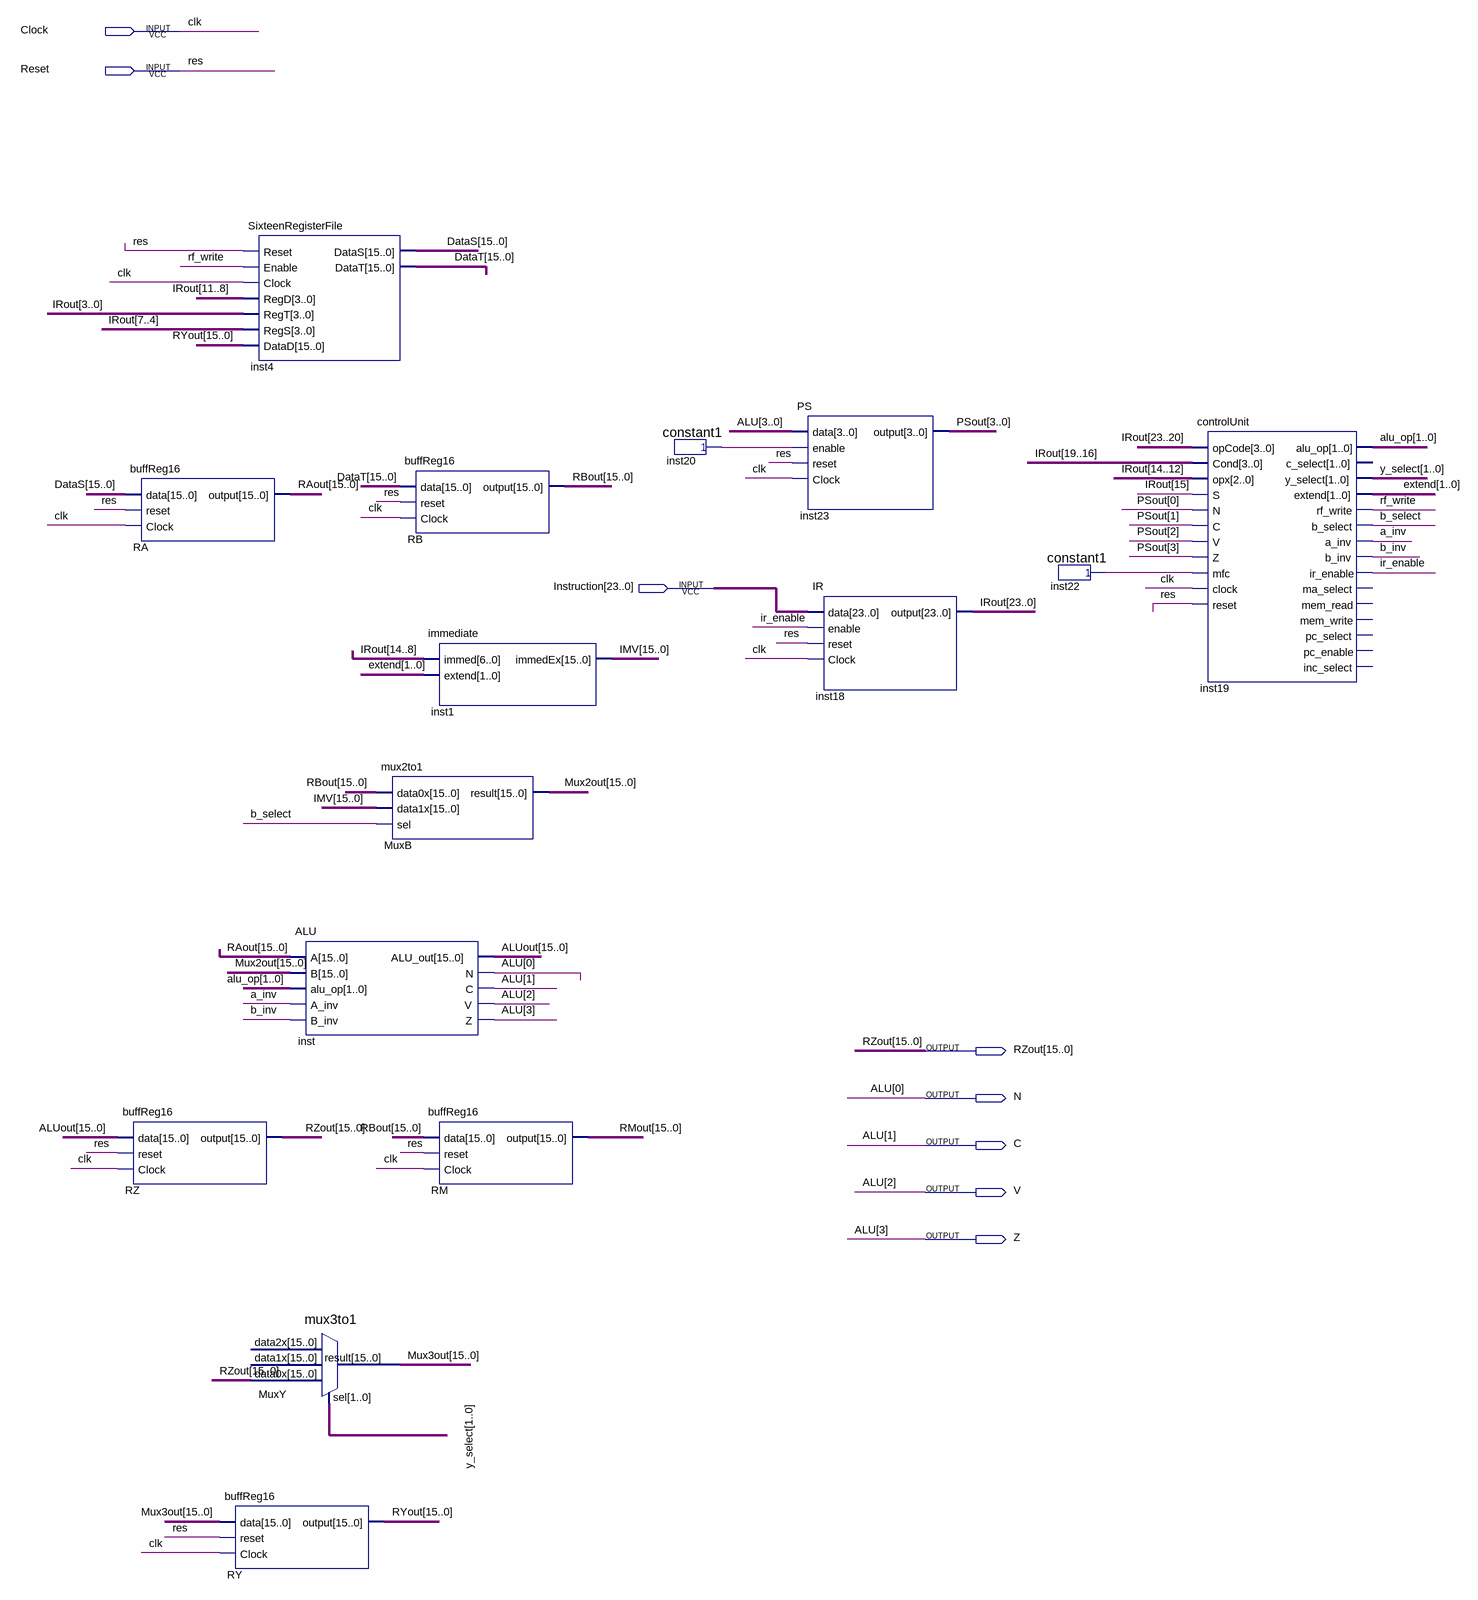
[diagram p0: schematic sheet]
// Quartus schematic Part2.bdf as structural Verilog: 15 symbols, 8 pins
module Part2 (
  input  Clock,
  input  Reset,
  input  [23:0] Instruction,
  output [15:0] RZout,
  output N,
  output C,
  output V,
  output Z
);

  wire a_inv, b_inv, b_select, inst20_result, inst22_result, ir_enable, rf_write;
  wire [1:0] alu_op, extend, y_select;
  wire [3:0] PSout;
  wire [15:0] ALUout, DataS, DataT, IMV, Mux2out, Mux3out, RAout, RBout, RMout, RYout;
  wire [23:0] IRout;

  buffReg16 RA (.data(DataS), .reset(Reset), .Clock(Clock), .\output (RAout));
  buffReg16 RZ (.data(ALUout), .reset(Reset), .Clock(Clock), .\output (RZout));
  SixteenRegisterFile inst4 (
    .Reset(Reset), .Enable(rf_write), .Clock(Clock), .RegD(IRout[11:8]), .RegT(IRout[3:0]),
    .RegS(IRout[7:4]), .DataD(RYout), .DataS(DataS), .DataT(DataT));
  mux3to1 MuxY (.data0x(RZout), .sel(y_select), .result(Mux3out));  // open: data2x, data1x
  buffReg16 RY (.data(Mux3out), .reset(Reset), .Clock(Clock), .\output (RYout));
  ALU inst (
    .A(RAout), .B(Mux2out), .alu_op(alu_op), .A_inv(a_inv), .B_inv(b_inv), .ALU_out(ALUout), .N(N), .C(C),
    .V(V), .Z(Z));
  mux2to1 MuxB (.data0x(RBout), .data1x(IMV), .sel(b_select), .result(Mux2out));
  buffReg16 RB (.data(DataT), .reset(Reset), .Clock(Clock), .\output (RBout));
  immediate inst1 (.immed(IRout[14:8]), .extend(extend), .immedEx(IMV));
  buffReg16 RM (.data(RBout), .reset(Reset), .Clock(Clock), .\output (RMout));
  constant1 inst20 (.result(inst20_result));
  PS inst23 (.data({Z, V, C, N}), .enable(inst20_result), .reset(Reset), .Clock(Clock), .\output (PSout));
  IR inst18 (.data(Instruction), .enable(ir_enable), .reset(Reset), .Clock(Clock), .\output (IRout));
  constant1 inst22 (.result(inst22_result));
  controlUnit inst19 (
    .opCode(IRout[23:20]), .Cond(IRout[19:16]), .opx(IRout[14:12]), .S(IRout[15]), .N(PSout[0]),
    .C(PSout[1]), .V(PSout[2]), .Z(PSout[3]), .mfc(inst22_result), .clock(Clock), .reset(Reset),
    .alu_op(alu_op), .y_select(y_select), .extend(extend), .rf_write(rf_write), .b_select(b_select),
    .a_inv(a_inv), .b_inv(b_inv), .ir_enable(ir_enable));  // open: c_select, ma_select, mem_read, mem_write, pc_select, pc_enable, inc_select

  // Other names for the same wires on the sheet: ALU[3:0] = {Z, V, C, N}; clk = Clock; res = Reset
endmodule
